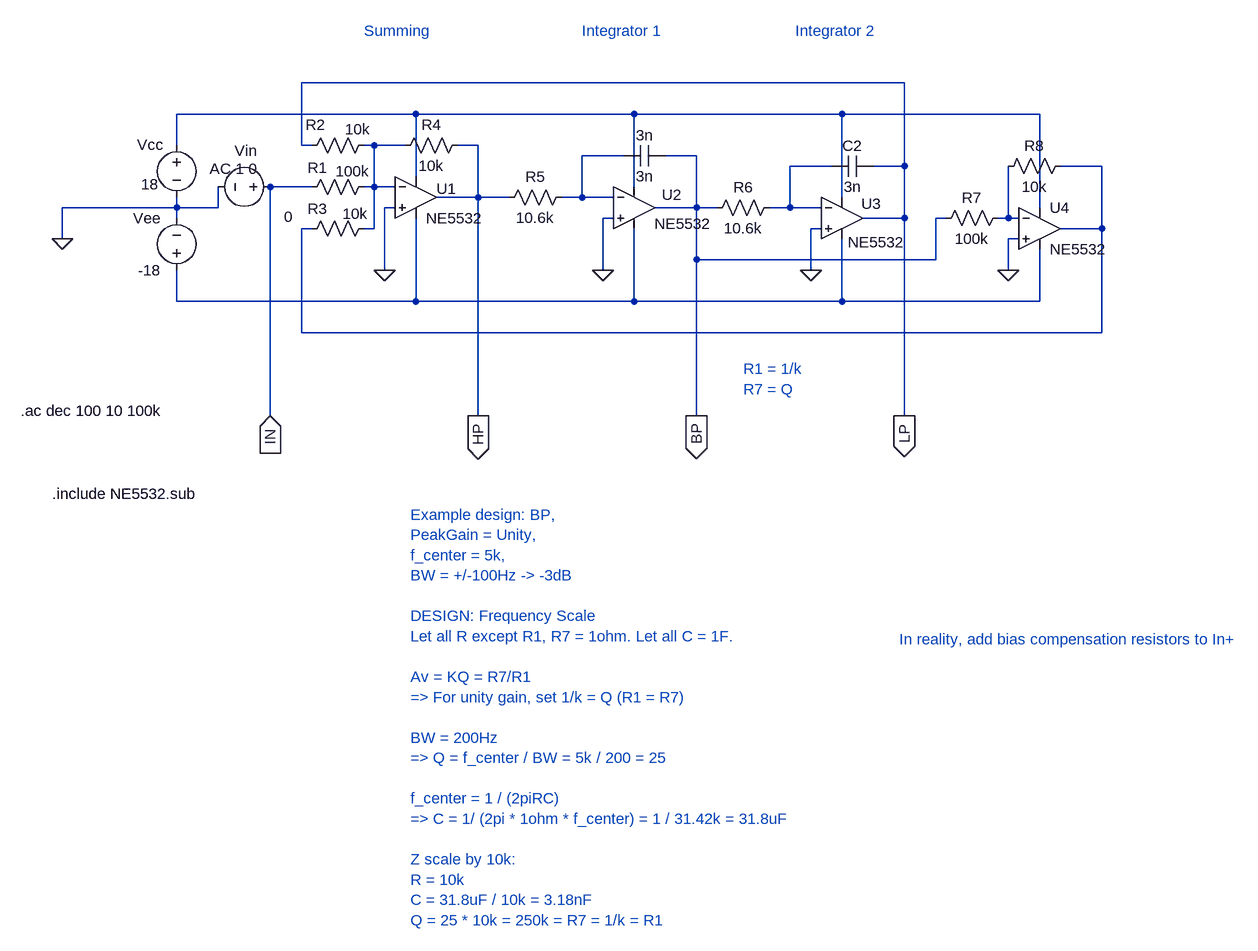
[diagram p0: schematic state_var.asc]
state_var.asc, the LTspice schematic file:
Version 4.1
SHEET 1 1388 1016
WIRE 816 -224 -112 -224
WIRE 64 -176 -304 -176
WIRE 400 -176 64 -176
WIRE 720 -176 400 -176
WIRE 1024 -176 720 -176
WIRE -304 -128 -304 -176
WIRE -112 -128 -112 -224
WIRE -96 -128 -112 -128
WIRE 0 -128 -16 -128
WIRE 48 -128 0 -128
WIRE 160 -128 128 -128
WIRE 384 -112 320 -112
WIRE 496 -112 448 -112
WIRE 704 -96 640 -96
WIRE 816 -96 816 -224
WIRE 816 -96 768 -96
WIRE 1120 -96 1056 -96
WIRE 64 -80 64 -176
WIRE -96 -64 -160 -64
WIRE 0 -64 0 -128
WIRE 0 -64 -16 -64
WIRE 32 -64 0 -64
WIRE 400 -64 400 -176
WIRE 160 -48 160 -128
WIRE 160 -48 96 -48
WIRE 208 -48 160 -48
WIRE 320 -48 320 -112
WIRE 320 -48 288 -48
WIRE 368 -48 320 -48
WIRE 720 -48 720 -176
WIRE -304 -32 -304 -48
WIRE -304 -32 -480 -32
WIRE -240 -32 -240 -64
WIRE -240 -32 -304 -32
WIRE 32 -32 16 -32
WIRE 496 -32 496 -112
WIRE 496 -32 432 -32
WIRE 528 -32 496 -32
WIRE 640 -32 640 -96
WIRE 640 -32 608 -32
WIRE 688 -32 640 -32
WIRE 1024 -32 1024 -176
WIRE -304 -16 -304 -32
WIRE 368 -16 352 -16
WIRE 816 -16 816 -96
WIRE 816 -16 752 -16
WIRE 880 -16 864 -16
WIRE 976 -16 976 -96
WIRE 976 -16 960 -16
WIRE 992 -16 976 -16
WIRE -96 0 -112 0
WIRE 0 0 0 -64
WIRE 0 0 -16 0
WIRE 688 0 672 0
WIRE 1120 0 1120 -96
WIRE 1120 0 1056 0
WIRE -480 16 -480 -32
WIRE 992 16 976 16
WIRE 496 48 496 -32
WIRE 864 48 864 -16
WIRE 864 48 496 48
WIRE 16 64 16 -32
WIRE 352 64 352 -16
WIRE 672 64 672 0
WIRE 976 64 976 16
WIRE -304 112 -304 64
WIRE 64 112 64 -16
WIRE 64 112 -304 112
WIRE 400 112 400 0
WIRE 400 112 64 112
WIRE 720 112 720 16
WIRE 720 112 400 112
WIRE 1024 112 1024 32
WIRE 1024 112 720 112
WIRE -112 160 -112 0
WIRE 1120 160 1120 0
WIRE 1120 160 -112 160
WIRE -160 288 -160 -64
WIRE 160 288 160 -48
WIRE 496 288 496 48
WIRE 816 288 816 -16
FLAG -480 16 0
FLAG -160 288 IN
IOPIN -160 288 In
FLAG 160 288 HP
IOPIN 160 288 Out
FLAG 496 288 BP
IOPIN 496 288 Out
FLAG 816 288 LP
IOPIN 816 288 Out
FLAG 16 64 0
FLAG 352 64 0
FLAG 672 64 0
FLAG 976 64 0
SYMBOL OpAmps\\opamp2 64 -112 R0
WINDOW 0 32 51 Left 2
SYMATTR InstName U1
SYMATTR Value NE5532
SYMBOL voltage -304 -144 R0
WINDOW 0 -61 15 Left 2
WINDOW 3 -55 76 Left 2
SYMATTR InstName Vcc
SYMATTR Value 18
SYMBOL voltage -304 80 R180
WINDOW 0 24 96 Left 2
WINDOW 3 24 16 Left 2
SYMATTR InstName Vee
SYMATTR Value -18
SYMBOL voltage -144 -64 R90
WINDOW 123 -28 36 VRight 2
WINDOW 39 0 0 Left 0
WINDOW 0 -56 36 VRight 2
WINDOW 3 46 -19 VRight 2
SYMATTR Value2 AC 1 0
SYMATTR InstName Vin
SYMATTR Value 0
SYMBOL res 0 -80 R90
WINDOW 0 2 87 VBottom 2
WINDOW 3 -24 33 VTop 2
SYMATTR InstName R1
SYMATTR Value 100k
SYMBOL OpAmps\\opamp2 400 -96 R0
WINDOW 0 43 44 Left 2
WINDOW 3 31 89 Left 2
SYMATTR InstName U2
SYMATTR Value NE5532
SYMBOL OpAmps\\opamp2 720 -80 R0
WINDOW 0 30 42 Left 2
WINDOW 3 9 101 Left 2
SYMATTR InstName U3
SYMATTR Value NE5532
SYMBOL res 144 -144 R90
WINDOW 0 0 56 VBottom 2
WINDOW 3 32 56 VTop 2
SYMATTR InstName R4
SYMATTR Value 10k
SYMBOL res 304 -64 R90
WINDOW 0 0 56 VBottom 2
WINDOW 3 32 56 VTop 2
SYMATTR InstName R5
SYMATTR Value 10.6k
SYMBOL cap 448 -128 R90
WINDOW 0 0 32 VBottom 2
WINDOW 3 32 32 VTop 2
SYMATTR InstName 3n
SYMATTR Value 3n
SYMBOL cap 768 -112 R90
WINDOW 0 0 32 VBottom 2
WINDOW 3 32 32 VTop 2
SYMATTR InstName C2
SYMATTR Value 3n
SYMBOL res 624 -48 R90
WINDOW 0 0 56 VBottom 2
WINDOW 3 32 56 VTop 2
SYMATTR InstName R6
SYMATTR Value 10.6k
SYMBOL res 0 -144 R90
WINDOW 0 0 90 VBottom 2
WINDOW 3 -24 25 VTop 2
SYMATTR InstName R2
SYMATTR Value 10k
SYMBOL res 0 -16 R90
WINDOW 0 1 87 VBottom 2
WINDOW 3 -22 29 VTop 2
SYMATTR InstName R3
SYMATTR Value 10k
SYMBOL OpAmps\\opamp2 1024 -64 R0
SYMATTR InstName U4
SYMATTR Value NE5532
SYMBOL res 1072 -112 R90
WINDOW 0 0 56 VBottom 2
WINDOW 3 32 56 VTop 2
SYMATTR InstName R8
SYMATTR Value 10k
SYMBOL res 976 -32 R90
WINDOW 0 0 56 VBottom 2
WINDOW 3 32 56 VTop 2
SYMATTR InstName R7
SYMATTR Value 100k
TEXT -496 408 Left 2 !.include NE5532.sub
TEXT -16 -304 Left 2 ;Summing
TEXT 320 -304 Left 2 ;Integrator 1
TEXT 648 -304 Left 2 ;Integrator 2
TEXT 56 440 Left 2 ;Example design: BP,\nPeakGain = Unity,\nf_center = 5k,\nBW = +/-100Hz -> -3dB\n \nDESIGN: Frequency Scale\nLet all R except R1, R7 = 1ohm. Let all C = 1F.\n \nAv = KQ = R7/R1\n=> For unity gain, set 1/k = Q (R1 = R7)\n \nBW = 200Hz\n=> Q = f_center / BW = 5k / 200 = 25\n \nf_center = 1 / (2piRC)\n=> C = 1/ (2pi * 1ohm * f_center) = 1 / 31.42k = 31.8uF\n \nZ scale by 10k:\nR = 10k\nC = 31.8uF / 10k = 3.18nF\nQ = 25 * 10k = 250k = R7 = 1/k = R1
TEXT 568 216 Left 2 ;R1 = 1/k\nR7 = Q
TEXT -544 280 Left 2 !.ac dec 100 10 100k
TEXT 808 632 Left 2 ;In reality, add bias compensation resistors to In+

The netlist it stands for:
* state_var.asc
X§U1 0 N002 N001 N007 HP NE5532  ; pins In+ In- V+ V- OUT
Vcc N001 0 18
Vee N007 0 -18
Vin IN 0 0 AC 1 0
R1 N002 IN 100k
X§U2 0 N003 N001 N007 BP NE5532  ; pins In+ In- V+ V- OUT
X§U3 0 N004 N001 N007 LP NE5532  ; pins In+ In- V+ V- OUT
R4 HP N002 10k
R5 N003 HP 10.6k
C§3n BP N003 3n
C2 LP N004 3n
R6 N004 BP 10.6k
R2 N002 LP 10k
R3 N002 N005 10k
X§U4 0 N006 N001 N007 N005 NE5532  ; pins In+ In- V+ V- OUT
R8 N005 N006 10k
R7 N006 BP 100k
.include NE5532.sub
* Summing
* Integrator 1
* Integrator 2
* Example design: BP,
* PeakGain = Unity,
* f_center = 5k,
* BW = +/-100Hz -> -3dB
* DESIGN: Frequency Scale
* Let all R except R1, R7 = 1ohm. Let all C = 1F.
* Av = KQ = R7/R1
* => For unity gain, set 1/k = Q (R1 = R7)
* BW = 200Hz
* => Q = f_center / BW = 5k / 200 = 25
* f_center = 1 / (2piRC)
* => C = 1/ (2pi * 1ohm * f_center) = 1 / 31.42k = 31.8uF
* Z scale by 10k:
* R = 10k
* C = 31.8uF / 10k = 3.18nF
* Q = 25 * 10k = 250k = R7 = 1/k = R1
* R1 = 1/k
* R7 = Q
.ac dec 100 10 100k
* In reality, add bias compensation resistors to In+
.backanno
.end